# Altium schematic sheet 1_P1.schdoc.schdoc
size 431 x 309 mm; Symbol: Sheet-Symbol_A4; Device: Sheet-Symbol_A4; Company: 嘉立创EDA; Version: V1.0; Page Size: A4; @Project Name: MAX30102 sensor; @Page Count: 1; @Update Date: 2024-01-17; @Create Date: 2024-01-11; @Schematic Name: Schematic1; @Page No: 1; @Page Name: P1
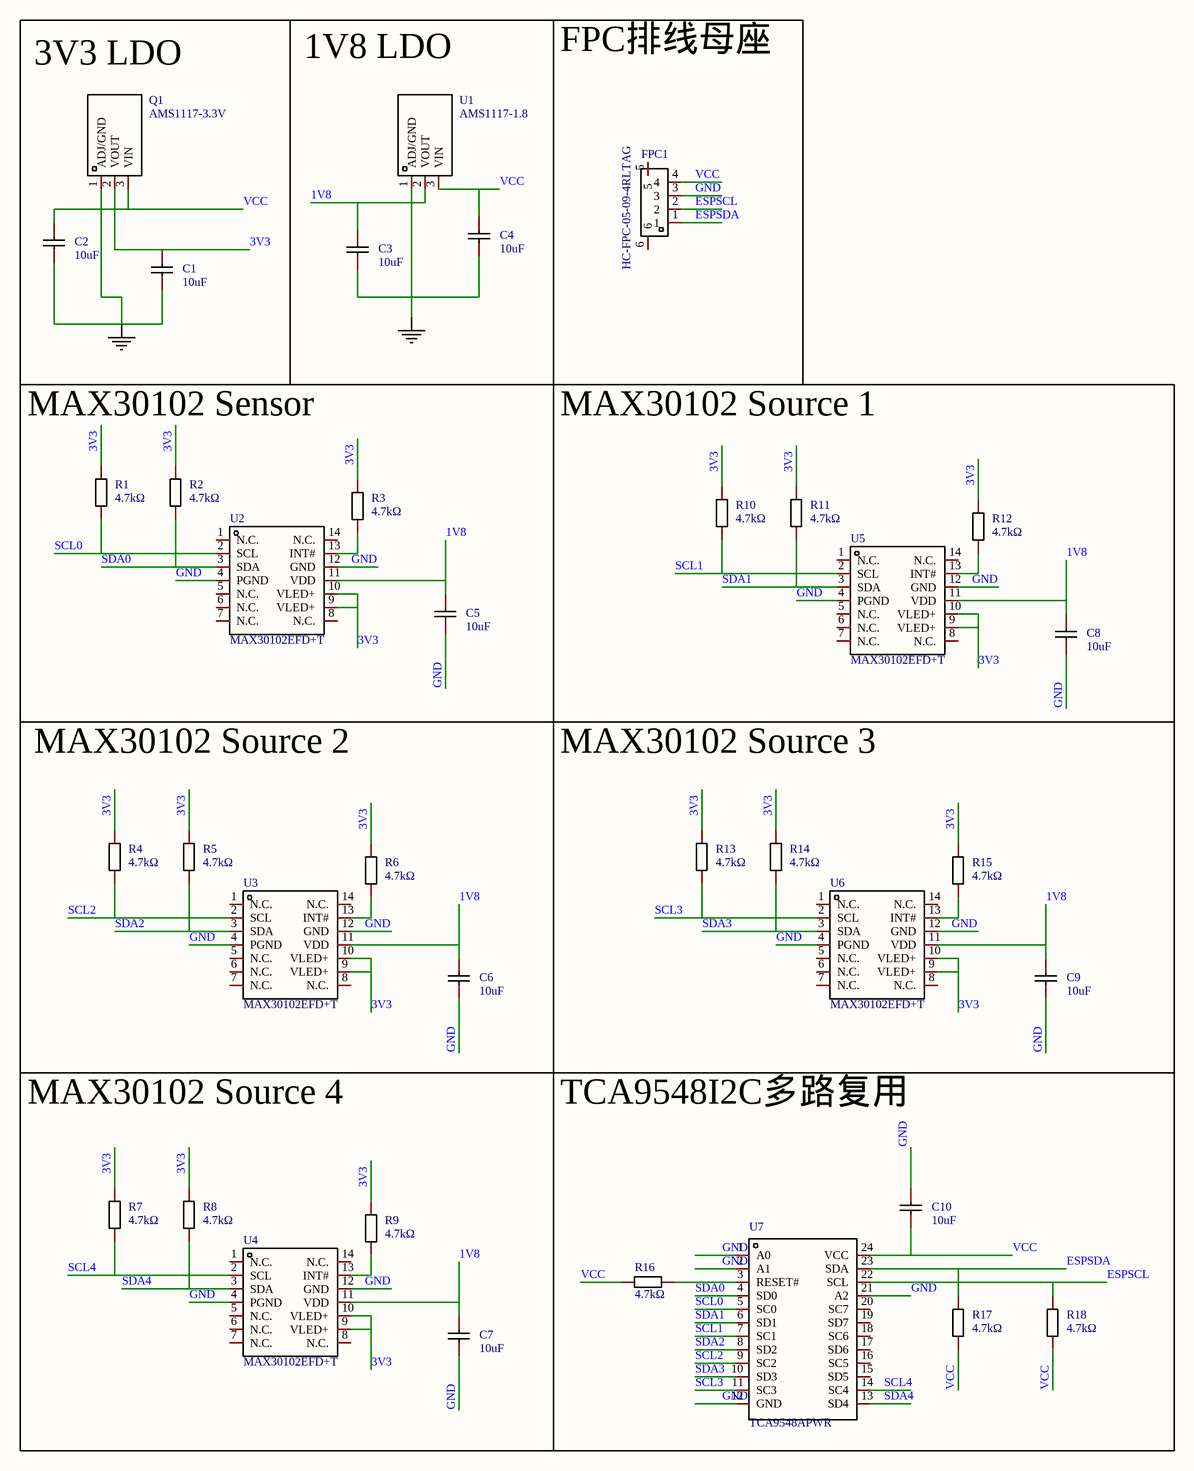
[diagram p0: 1_P1.schdoc.schdoc]

## Parts
C1  10uF  [C0402]
C2  10uF  [C0402]
C3  10uF  [C0402]
C4  10uF  [C0402]
C5  10uF  [C0402]
C6  10uF  [C0402]
C7  10uF  [C0402]
C8  10uF  [C0402]
C9  10uF  [C0402]
C10  10uF  [C0402]
FPC1  HC-FPC-05-09-4RLTAG  [FPC-SMD_4P-P0.50_HC-FPC-05-09-4RLTAG]
Q1  AMS1117-3.3V  [SOT-89-3_L4.5-W2.5-P1.50-LS4.2-BR]
R1  4.7kΩ  [R0402]
R2  4.7kΩ  [R0402]
R3  4.7kΩ  [R0402]
R4  4.7kΩ  [R0402]
R5  4.7kΩ  [R0402]
R6  4.7kΩ  [R0402]
R7  4.7kΩ  [R0402]
R8  4.7kΩ  [R0402]
R9  4.7kΩ  [R0402]
R10  4.7kΩ  [R0402]
R11  4.7kΩ  [R0402]
R12  4.7kΩ  [R0402]
R13  4.7kΩ  [R0402]
R14  4.7kΩ  [R0402]
R15  4.7kΩ  [R0402]
R16  4.7kΩ  [R0402]
R17  4.7kΩ  [R0402]
R18  4.7kΩ  [R0402]
U1  AMS1117-1.8  [SOT-89-3_L4.5-W2.5-P1.50-LS4.2-BR]
U2  MAX30102EFD+T  [OESIP-14_L5.6-W3.3-P0.80-TL]
U3  MAX30102EFD+T  [OESIP-14_L5.6-W3.3-P0.80-TL]
U4  MAX30102EFD+T  [OESIP-14_L5.6-W3.3-P0.80-TL]
U5  MAX30102EFD+T  [OESIP-14_L5.6-W3.3-P0.80-TL]
U6  MAX30102EFD+T  [OESIP-14_L5.6-W3.3-P0.80-TL]
U7  TCA9548APWR  [TSSOP-24_L7.8-W4.4-P0.65-LS6.4-BL]

## Blocks framed on the sheet
3V3 LDO: C1 C2 Q1
1V8 LDO: C3 C4 U1
FPC排线母座: FPC1
MAX30102 Sensor: C5 R1-R3 U2
MAX30102 Source 1: C8 R10-R12 U5
MAX30102 Source 2: C6 R4-R6 U3
MAX30102 Source 3: C9 R13-R15 U6
MAX30102 Source 4: C7 R7-R9 U4
TCA9548I2C多路复用: C10 R16-R18 U7

## Nets
NetC1_1: C1.1 C2.1 C3.1 C4.1 Q1.1(ADJ/GND) U1.1(ADJ/GND)
1V8: C3.2 C5.2 C6.1 C7.2 C8.2 C9.2 U1.2(VOUT) U2.11(VDD) U3.11(VDD) U4.11(VDD) U5.11(VDD) U6.11(VDD)
3V3: C1.2 Q1.2(VOUT) R1.2 R2.2 R3.2 R4.2 R5.2 R6.2 R7.2 R8.2 R9.2 R10.2 R11.2 R12.2 R13.2 R14.2 R15.2 U2.9(VLED+) U2.10(VLED+) U3.9(VLED+) U3.10(VLED+) U4.9(VLED+) U4.10(VLED+) U5.9(VLED+) U5.10(VLED+) U6.9(VLED+) U6.10(VLED+)
ESPSCL: FPC1.2 R18.2 U7.22(SCL)
ESPSDA: FPC1.1 R17.2 U7.23(SDA)
GND: C5.1 C6.2 C7.1 C8.1 C9.1 C10.2 FPC1.3 U2.4(PGND) U2.12(GND) U3.4(PGND) U3.12(GND) U4.4(PGND) U4.12(GND) U5.4(PGND) U5.12(GND) U6.4(PGND) U6.12(GND) U7.1(A0) U7.2(A1) U7.12(GND) U7.21(A2)
SCL0: R1.1 U2.2(SCL) U7.5(SC0)
SCL1: R10.1 U5.2(SCL) U7.7(SC1)
SCL2: R4.1 U3.2(SCL) U7.9(SC2)
SCL3: R13.1 U6.2(SCL) U7.11(SC3)
SCL4: R7.1 U4.2(SCL) U7.14(SC4)
SDA0: R2.1 U2.3(SDA) U7.4(SD0)
SDA1: R11.1 U5.3(SDA) U7.6(SD1)
SDA2: R5.1 U3.3(SDA) U7.8(SD2)
SDA3: R14.1 U6.3(SDA) U7.10(SD3)
SDA4: R8.1 U4.3(SDA) U7.13(SD4)
VCC: C2.2 C4.2 C10.1 FPC1.4 Q1.3(VIN) R16.1 R17.1 R18.1 U1.3(VIN) U7.24(VCC)
NetR3_1: R3.1 U2.13(INT#)
NetR6_1: R6.1 U3.13(INT#)
NetR9_1: R9.1 U4.13(INT#)
NetR12_1: R12.1 U5.13(INT#)
NetR15_1: R15.1 U6.13(INT#)
NetR16_2: R16.2 U7.3(RESET#)

Not connected (* = marked no-connect by the designer): FPC1 5 6; U2 1(N.C.) 5(N.C.) 6(N.C.) 7(N.C.) 8(N.C.) 14(N.C.); U3 1(N.C.) 5(N.C.) 6(N.C.) 7(N.C.) 8(N.C.) 14(N.C.); U4 1(N.C.) 5(N.C.) 6(N.C.) 7(N.C.) 8(N.C.) 14(N.C.); U5 1(N.C.) 5(N.C.) 6(N.C.) 7(N.C.) 8(N.C.) 14(N.C.); U6 1(N.C.) 5(N.C.) 6(N.C.) 7(N.C.) 8(N.C.) 14(N.C.); U7 15(SD5) 16(SC5) 17(SD6) 18(SC6) 19(SD7) 20(SC7)

## Notes on the sheet
- 1
- 2
- 3
- 4
- 5
- 6
- A
- B
- C
- D
- 原理图
- Schematic1
- 创建日期
- 更新日期
- 2024-01-17
- 2024-01-11
- 审阅
- 绘制
- 图页
- P1
- 物料编码
- MAX30102 sensor
- 版本
- 尺寸
- 页
- 共
- V1.0
- A4
- 嘉立创EDA

## Library data of the parts
C1-C10 = CL05A106MQ5NUNC: Manufacturer: SAMSUNG(三星); Add into BOM: yes; Tolerance: ±20%; Voltage Rated: 6.3V; Temperature Coefficient: X5R; Description: 容值:10uF;精度:±20%;额定电压:6.3V;材质(温度系数):X5R;; Name: 10uF; Symbol: CL05A106MQ5NUNC; Device: CL05A106MQ5NUNC; Supplier: LCSC; Manufacturer Part: CL05A106MQ5NUNC; Value: 10uF; Supplier Part: C15525; LCSC Part Name: 10uF ±20% 6.3V; Supplier Footprint: 0402; Datasheet: https://atta.szlcsc.com/upload/public/pdf/source/20220823/2B02EE04F8F211D38A52DCB16EB6BEBA.pdf; Convert to PCB: yes
FPC1 = HC-FPC-05-09-4RLTAG: Manufacturer: HCTL(华灿天禄); Add into BOM: yes; Locking Feature: 翻盖式; Number of Contacts: 4P; Pitch: 0.5mm; Description: 锁定特性:翻盖式;触点类型:双侧触点/上下接;触点数量:4P;间距:0.5mm;安装类型:卧贴;工作温度范围:-;焊接温度(最大值):-;; Name: HC-FPC-05-09-4RLTAG; Symbol: HC-FPC-05-09-4RLTAG; Device: HC-FPC-05-09-4RLTAG; Supplier: LCSC; Supplier Part: C5213746; Manufacturer Part: HC-FPC-05-09-4RLTAG; LCSC Part Name: 翻盖式 双侧触点/上下接 P数:4P 间距:0.5mm; Supplier Footprint: SMD,P=0.5mm,卧贴; Datasheet: https://atta.szlcsc.com/upload/public/pdf/source/20221026/52A26161A88FCE07A06989F8D4399614.pdf; Convert to PCB: yes; Contact Type: 双侧触点/上下接; Mounting Type: 卧贴; FFC, FCB Thickness: -; Height Above Board: 1mm; Contact Material: -; Contact Plating: -; Operating Temperature Range: -; Welding Temperature (Max): -
Q1 = AMS1117-3.3V_C5120796: Manufacturer: MSKSEMI(美森科); Add into BOM: yes; Output Type: 固定; Maximum Input Voltage: 18V; Output Voltage: 3.3V; MAX Output Current: 1A; Dropout Voltage: 1.4V@(1A); standby current: 12mA; Output Polarity: 正极; Number of Outputs: 1; Description: 输出类型:固定;最大输入电压:18V;输出电压:3.3V;最大输出电流:1A;输出极性:正极;; Name: AMS1117-3.3V; Symbol: AMS1117-3.3V_C5120796; Device: AMS1117-3.3V_C5120796; Supplier: LCSC; Supplier Part: C5120796; Manufacturer Part: AMS1117-3.3V; LCSC Part Name: 输入18V 输出3.3V 1A; Supplier Footprint: SOT-89; Datasheet: https://atta.szlcsc.com/upload/public/pdf/source/20231123/6117526697EB8BF6175FDEEBA0877266.pdf; Convert to PCB: yes; Operating Temperature: 0℃~+125℃
R1-R18 = 0402WGF4701TCE: Manufacturer: UNI-ROYAL(厚声); Add into BOM: yes; Tolerance: ±1%; Power(Watts): 62.5mW; Overload Voltage (Max): 50V; Temperature Coefficient: ±100ppm/℃; Description: 阻值:4.7kΩ;精度:±1%;功率:62.5mW;温度系数:±100ppm/℃;电阻类型:厚膜电阻;; Name: 4.7kΩ; Symbol: 0402WGF4701TCE; Device: 0402WGF4701TCE; Supplier: LCSC; Manufacturer Part: 0402WGF4701TCE; Supplier Part: C25900; Value: 4.7kΩ; LCSC Part Name: 4.7kΩ ±1% 62.5mW 厚膜电阻; Supplier Footprint: 0402; Datasheet: https://atta.szlcsc.com/upload/public/pdf/source/20200306/C422600_1E6D84923E4A46A82E41ADD87F860B5C.pdf; Convert to PCB: yes; Type: 厚膜电阻; Operating Temperature Range: -55℃~+155℃
U1 = AMS1117-1.8_C880751: Manufacturer: Slkor(萨科微); Add into BOM: yes; Description: 输出类型:-;; Name: AMS1117-1.8; Symbol: AMS1117-1.8_C880751; Device: AMS1117-1.8_C880751; Supplier: LCSC; Supplier Part: C880751; Manufacturer Part: AMS1117-1.8; LCSC Part Name: AMS1117-1.8; Supplier Footprint: SOT-89-3; Datasheet: https://atta.szlcsc.com/upload/public/pdf/source/20190906/C426566_95BE246DE70C248781207323626ADB09.pdf; Convert to PCB: yes; Output Type: -
U2-U6 = MAX30102EFD+T_1: Manufacturer: ADI(亚德诺)/MAXIM(美信); Symbol: MAX30102EFD+T_C6454833; Add into BOM: yes; Name: MAX30102EFD+T; Device: MAX30102EFD+T_1; Supplier: LCSC; Supplier Part: C6454833; Manufacturer Part: MAX30102EFD+T; LCSC Part Name: MAX30102EFD+T; Supplier Footprint: OESIP-14; Datasheet: https://atta.szlcsc.com/upload/public/pdf/source/20230523/5357A0E2EBB238F1082B332F3131EA1A.pdf; Convert to PCB: yes; Operating Temperature: -40℃~+85℃
U7 = TCA9548APWR: Manufacturer: TI(德州仪器); Add into BOM: yes; Description: 类型:总线开关;电压-电源:1.65V ~ 5.5V;电路:1 x 8：1;电压源:单电源;逻辑电路的归属系列:TCA;; Name: TCA9548APWR; Symbol: TCA9548APWR; Device: TCA9548APWR; LCSC Part Name: TCA9548APWR; Supplier Part: C130026; Manufacturer Part: TCA9548APWR; Supplier Footprint: TSSOP-24; Datasheet: https://atta.szlcsc.com/upload/public/pdf/source/20170918/C130026_1505703263473975110.pdf; Supplier: LCSC; Convert to PCB: yes